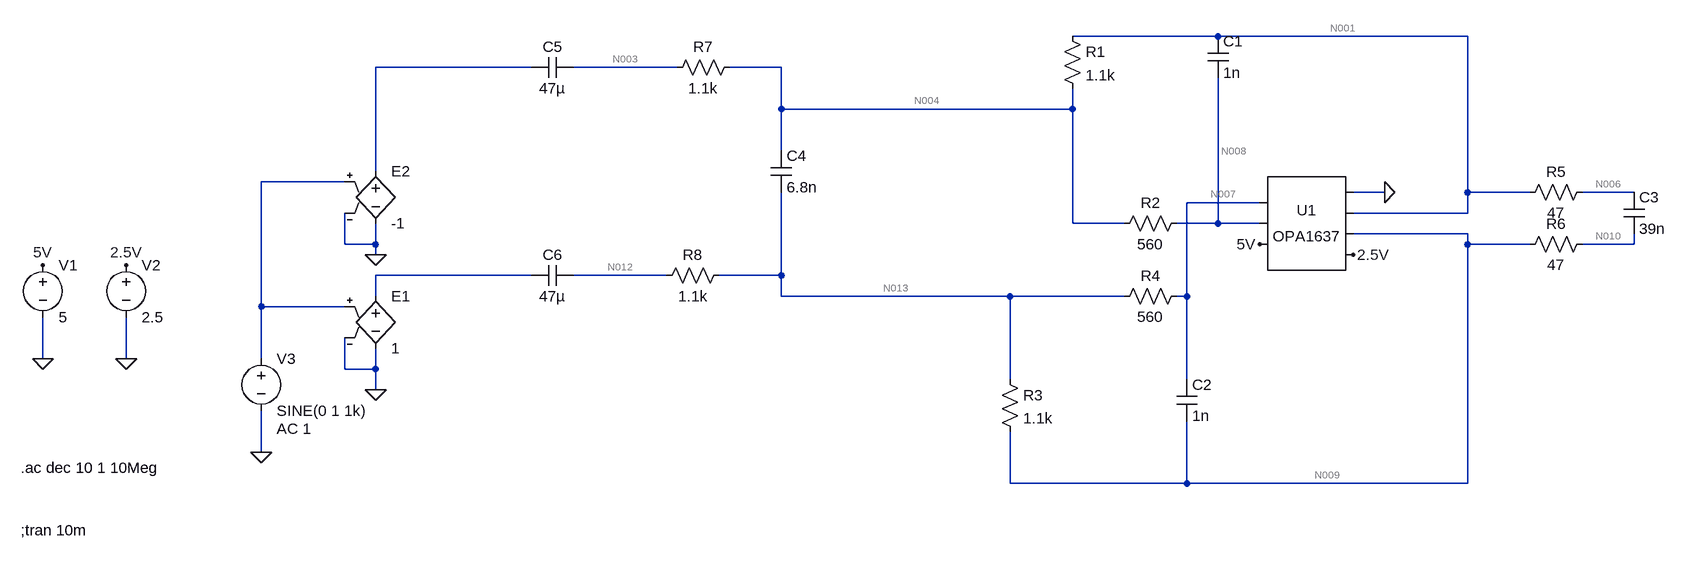
[diagram p0: schematic diff_amp_sim2.asc]
* diff_amp_sim2.asc
* U1: OPA1637 (symbol AutoGenerated\OPA1637 not available, pins judged from their places): pin1=N007 pin2=N008 pin3=5V pin4=0 pin5=N001 pin6=N009 pin7=2.5V
V1 5V 0 5
V2 2.5V 0 2.5
V3 N005 0 SINE(0 1 1k) AC 1
E1 N011 0 N005 0 1
E2 N002 0 N005 0 -1
R7 N004 N003 1.1k
R8 N013 N012 1.1k
C4 N004 N013 6.8n
C1 N001 N008 1n
R1 N001 N004 1.1k
R2 N008 N004 560
C2 N007 N009 1n
R3 N013 N009 1.1k
R4 N007 N013 560
C3 N006 N010 39n
R5 N006 N001 47
R6 N010 N009 47
C5 N003 N002 47µ
C6 N012 N011 47µ
.ac dec 10 1 10Meg
;tran 10m
.backanno
.end

* Results of the author's LTspice run, read from the files saved beside the schematic
* Operating Point, zero values left out:
*   V(n001) = 2.499 V
*   V(n009) = 2.499 V
*   V(5v) = 5 V
*   V(2.5v) = 2.5 V
*   V(n008) = 2.499 V
*   V(n007) = 2.499 V
*   V(n004) = 2.499 V
*   V(n003) = 2.499 V
*   V(n013) = 2.499 V
*   V(n012) = 2.499 V
*   V(n006) = 2.499 V
*   V(n010) = 2.499 V
*   I(R4) = -200.2 pA
*   I(R3) = -200.2 pA
*   I(R2) = -100.2 pA
*   I(R1) = 100.2 pA
*   I(V1) = -950.5 µA
*   Ix(u1:IN+) = 200.2 pA
*   Ix(u1:IN-) = 100.2 pA
*   Ix(u1:VCC) = 950.5 µA
*   Ix(u1:VEE) = -950.5 µA
*   Ix(u1:OUT+) = -100.2 pA
*   Ix(u1:OUT-) = -200.2 pA
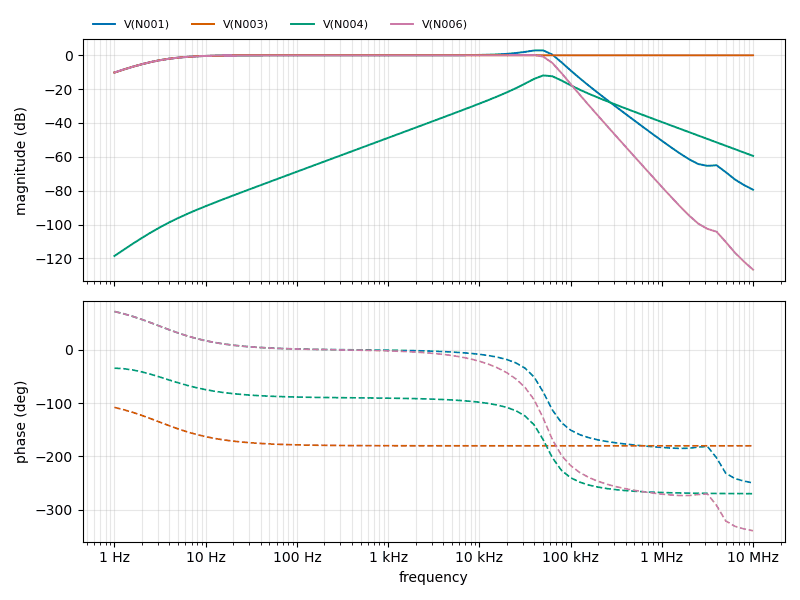
[diagram p1: AC Analysis of diff_amp_sim2.asc, plotted from the saved traces]
* AC Analysis, 1 run:
*   V(N001): -10.20 dB at 1 Hz, -79.45 dB at 10 MHz, peak 2.88 dB at 50.12 kHz, 3 dB below the peak at 17.54 Hz and 64.74 kHz
*   V(N003): -10.20 dB at 1 Hz, -0.00 dB at 10 MHz, peak 0.00 dB at 25.12 kHz, 3 dB below the peak at 3.086 Hz
*   V(N004): -118.60 dB at 1 Hz, -59.46 dB at 10 MHz, peak -11.90 dB at 50.12 kHz, 3 dB below the peak at 36.82 kHz and 79.4 kHz
*   V(N006): -10.20 dB at 1 Hz, -126.70 dB at 10 MHz, peak 0.17 dB at 39.81 kHz, 3 dB below the peak at 3.21 Hz and 56.78 kHz